# EAGLE design CELL PHONE DETECTOR (EAGLE 6.5.0)
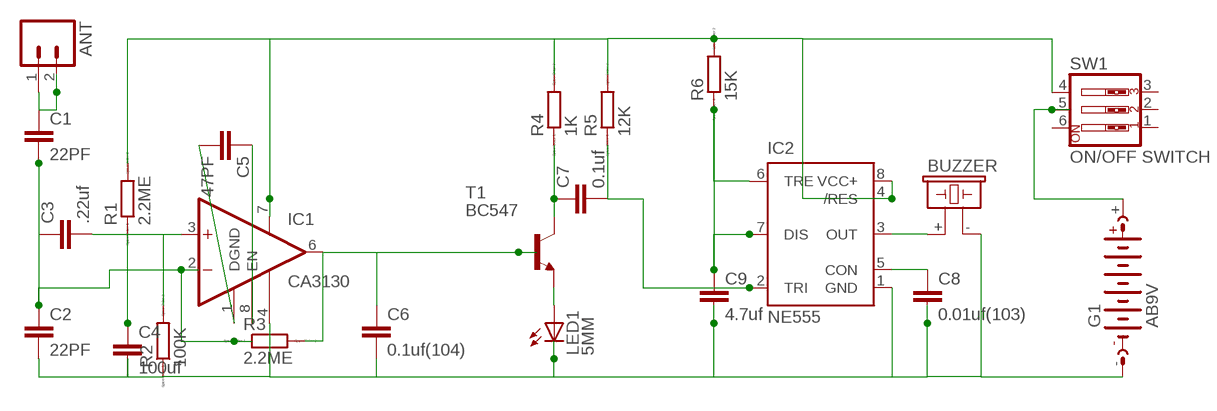
[diagram p0: schematic, sheet 1]

## Parts
ANT  M02  [02P]
BUZZER  F/CM12P  [F/CM12P]
C1  22PF  C2.5/6  [C2.5-6]
C2  22PF  C2.5/6  [C2.5-6]
C3  .22uf  C5/7.2  [C5B7.2]
C4  100uf  C2.5/6  [C2.5-6]
C5  47PF  C5/5  [C5B5]
C6  0.1uf(104)  C5/5  [C5B5]
C7  0.1uf  C5/5  [C5B5]
C8  0.01uf(103)  C5/5  [C5B5]
C9  4.7uf  C2,5-3  [C2.5-3]
G1  AB9V  [AB9V]
IC1  CA3130  OPA726P  [DIL08]
IC2  NE555  [DIL-08]
LED1  5MM  LED5MM  [LED5MM]
R1  2.2ME  R0204/7  [0204/7]
R2  100K  R0204/7  [0204/7]
R3  2.2ME  R0204/7  [0204/7]
R4  1K  R0204/7  [0204/7]
R5  12K  R0204/7  [0204/7]
R6  15K  R0204/7  [0204/7]
SW1  ON/OFF SWITCH  SW_DIP-3  [EDG-03]
T1  BC547  [TO92]

## Nets
N$1: C3.2 C4.1 IC1.3(+IN) R1.1 R2.2
N$2: C1.2 C2.1 C3.1 IC1.2(-IN) R3.1
N$3: ANT.1 ANT.2 C1.1
N$4: BUZZER.- C2.2 C4.2 C6.2 C8.2 C9.2 G1.- IC1.4(V-) IC2.1(GND) LED1.K(C) R2.1
N$7: C6.1 IC1.6(OUT) R3.2 T1.2(B)
N$8: C5.2 IC1.1(DGND)
N$9: C5.1 IC1.8(EN)
N$10: LED1.A T1.1(E)
N$11: C7.1 R4.1 T1.3(C)
N$12: C7.2 IC2.2(TRI) R5.1
N$13: IC1.7(V+) IC2.4(/RES) IC2.8(VCC+) R1.2 R4.2 R5.2 R6.2 SW1.4
N$14: C9.1 IC2.6(TRE) IC2.7(DIS) R6.1
N$15: C8.1 IC2.5(CON)
N$16: BUZZER.+ IC2.3(OUT)
N$18: G1.+ SW1.5
Unconnected: SW1.1 SW1.2 SW1.3 SW1.6

## Library data of the parts
ANT = con-amp-quick:M02: AMP QUICK CONNECTOR; OC_FARNELL: unknown; OC_NEWARK: unknown
BUZZER = buzzer:F/CM12P: BUZZER Source: Buerklin; OC_FARNELL: unknown; OC_NEWARK: unknown
C1-C9 = capacitor-wima:C: CAPACITOR naming: grid - package width
G1 = battery:AB9V: 9-V BATTERY CLIP
IC1 = linear:OPA726: Very Low Noise, High-Speed, 12V CMOS Operational Amplifier with Shutdown Source: http://focus.ti.com/lit/ds/symlink/opa725.pdf
IC2 = st-microelectronics:NE555: General purpose bipolar Timer; MF: Arrow Electronics; MPN: NE555N; OC_FARNELL: 1467742; OC_NEWARK: 89K1486
LED1 = led:LED: LED OSRAM: - CHIPLED LG R971, LG N971, LY N971, LG Q971, LY Q971, LO R971, LY R971 LH N974, LH R974 LS Q976, LO Q976, LY Q976 LO Q996 - Hyper CHIPLED LW Q18S LB Q993, LB Q99A, LB R99A - SideLED LS A670, LO A670, LY A670, LG A670, LP A670 LB A673, LV A673, LT A673, LW A673 LH A674 LY A675 LS A676, LA A676, LO A676, LY A676, LW A676 LS A679, LY A679, LG A679 - Hyper Micro SIDELED® LS Y876, LA Y876, LO Y876, LY Y876 LT Y87S - SmartLED LW L88C, LW L88S LB L89C, LB L89S, LG L890 LS L89K, LO L89K, LY L89K LS L896, LA L896, LO L896, LY L896 - TOPLED LS T670, LO T670, LY T670, LG T670, LP T670 LSG T670, LSP T670, LSY T670, LOP T670, LYG T670 LG T671, LOG T671, LSG T671 LB T673, LV T673, LT T673, LW T673 LH T674 LS T676, LA T676, LO T676, LY T676, LB T676, LH T676, LSB T676, LW T676 LB T67C, LV T67C, LT T67C, LS T67K, LO T67K, LY T67K, LW E67C LS E67B, LA E67B, LO E67B, LY E67B, LB E67C, LV E67C, LT E67C LW T67C LS T679, LY T679, LG T679 LS T770, LO T770, LY T770, LG T770, LP T770 LB T773, LV T773, LT T773, LW T773 LH T774 LS E675, LA E675, LY E675, LS T675 LS T776, LA T776, LO T776, LY T776, LB T776 LHGB T686 LT T68C, LB T68C - Hyper Mini TOPLED® LB M676 - Mini TOPLED Santana® LG M470 LS M47K, LO M47K, LY M47K Source: http://www.osram.convergy.de LUXEON: - LUMILED® LXK2-PW12-R00, LXK2-PW12-S00, LXK2-PW14-U00, LXK2-PW14-V00 LXK2-PM12-R00, LXK2-PM12-S00, LXK2-PM14-U00 LXK2-PE12-Q00, LXK2-PE12-R00, LXK2-PE12-S00, LXK2-PE14-T00, LXK2-PE14-U00 LXK2-PB12-K00, LXK2-PB12-L00, LXK2-PB12-M00, LXK2-PB14-N00, LXK2-PB14-P00, LXK2-PB14-Q00 LXK2-PR12-L00, LXK2-PR12-M00, LXK2-PR14-Q00, LXK2-PR14-R00 LXK2-PD12-Q00, LXK2-PD12-R00, LXK2-PD12-S00 LXK2-PH12-R00, LXK2-PH12-S00 LXK2-PL12-P00, LXK2-PL12-Q00, LXK2-PL12-R00 Source: www.luxeon.com KINGBRIGHT: KA-3528ASYC Source: www.kingbright.com
R1-R6 = eagle-ltspice:R: RESISTOR, European symbol; SPICEMODEL: NONE; SPICEPREFIX: R
SW1 = special:SW_DIP-3: DIP SWITCH
T1 = transistor:BC547: NPN TRANSISTOR

## Board
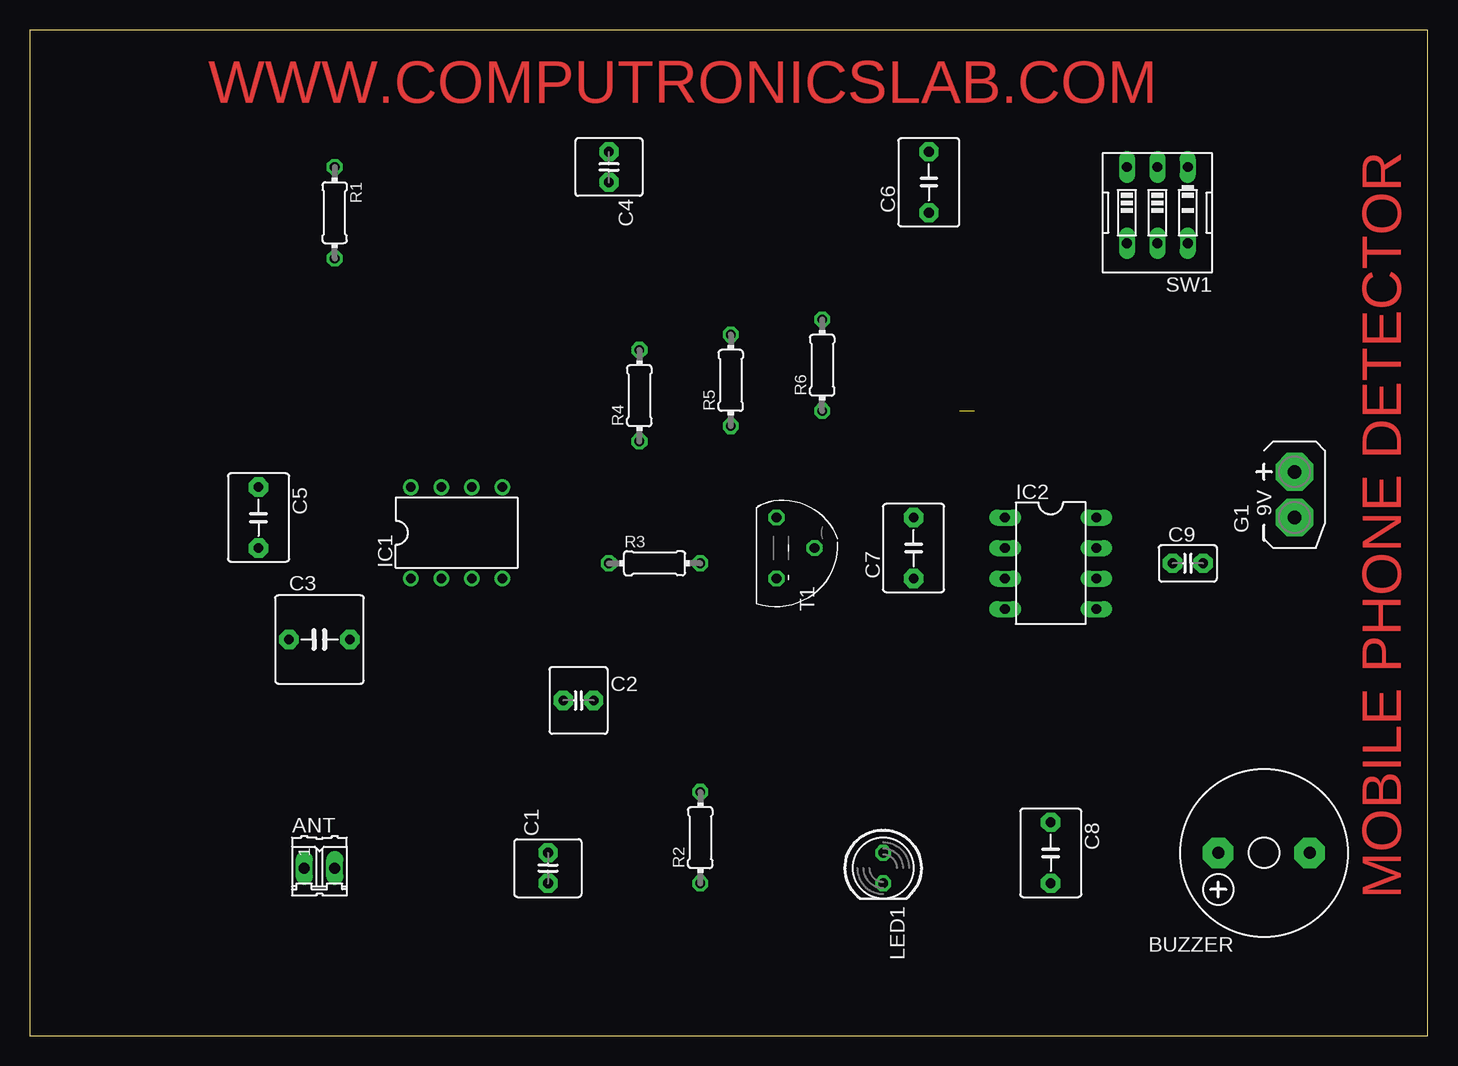
[diagram p1: board, top side]
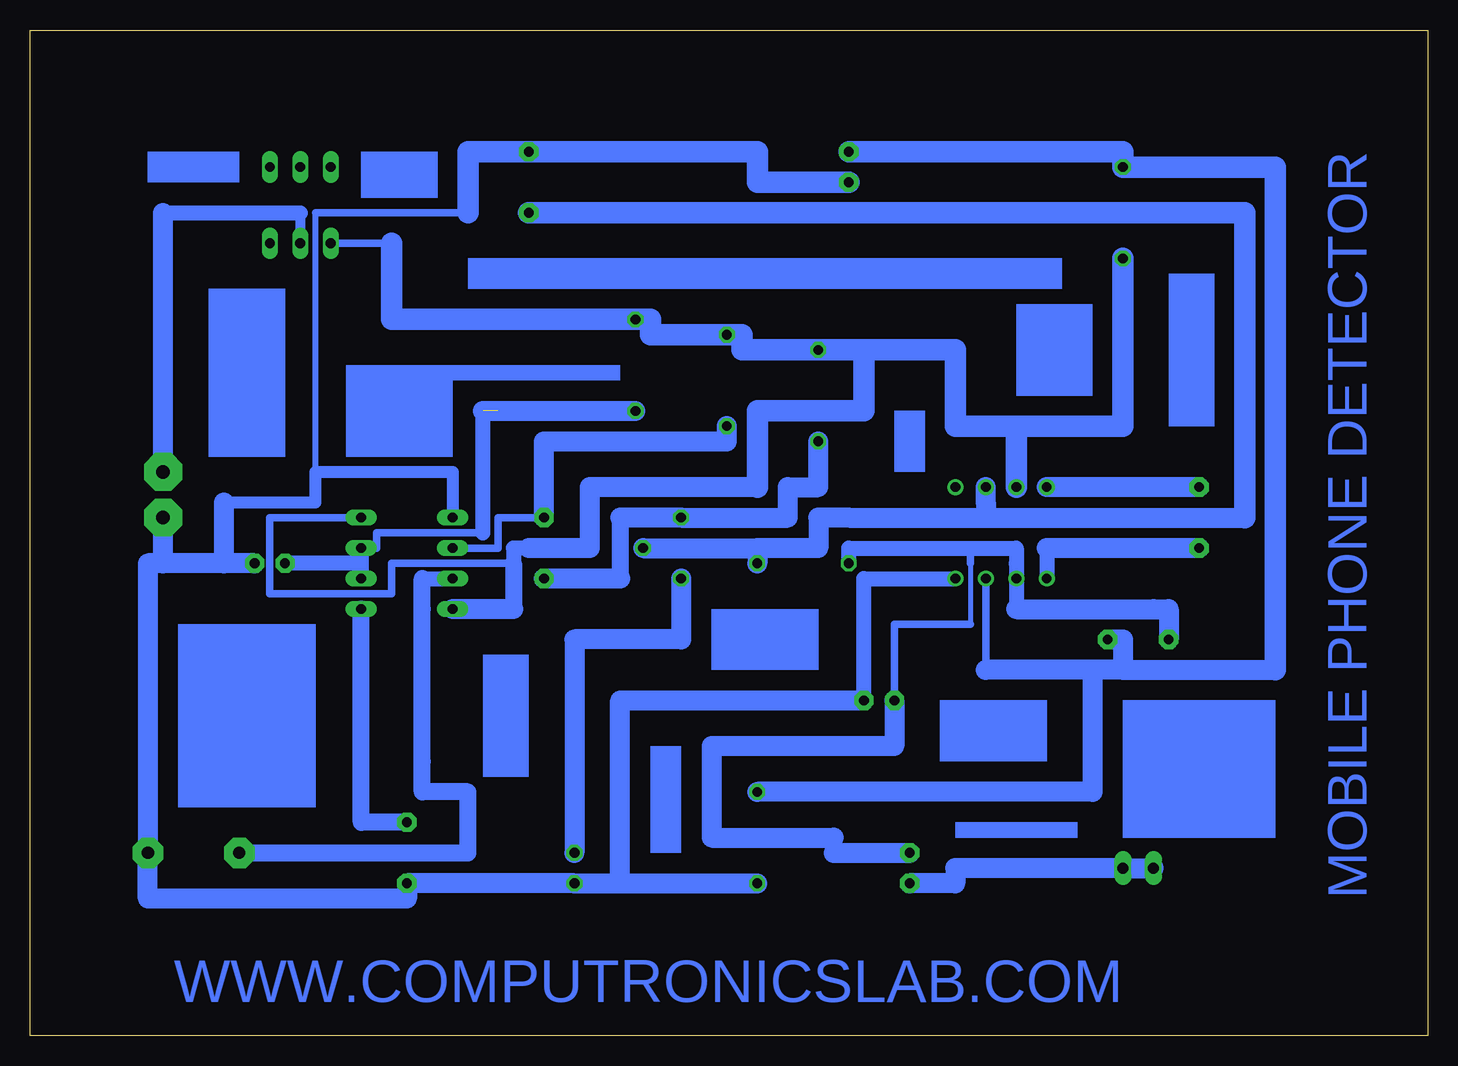
[diagram p2: board, bottom side, seen from below]

Size 116.51 x 83.81 mm. Coordinates in mm from the lower left corner, seen from the top.
Outline: 0,0 116.51,0 116.51,83.81 0,83.81 0,0
Copper layers (1*16): Top 0.035mm / dielectric 1.5mm / Bottom 0.035mm
Design rules "default": minimum track width 10mil, minimum drill 24mil, track to track 8mil, track to pad 8mil, pad to pad 8mil, via to via 8mil, smd to smd 8mil, copper to edge 40mil, drill to drill 8mil, minimum pad ring 10mil, minimum via ring 8mil, stop-mask expansion 4mil, vias tented up to drill 0mil, thermal gap 10mil

### Footprints (pad centres in the part's own frame; a part is rotated, then mirrored left to right if it is on the bottom)
02P = drill 0.914 long: 1 -1.27,0; 2 1.27,0
F/CM12P = drill 1.016 pad 2.54 octagon: + 3.81,0; - -3.81,0
C2.5-6 = drill 0.813 pad 1.6 octagon: 1 -1.27,0; 2 1.27,0
C5B7.2 = drill 0.813 pad 1.6 octagon: 1 -2.54,0; 2 2.54,0
C5B5 = drill 0.813 pad 1.6 octagon: 1 -2.54,0; 2 2.54,0
C2.5-3 = drill 0.813 pad 1.6 octagon: 1 -1.27,0; 2 1.27,0
AB9V = drill 1.118 pad 3.15 octagon: + 0,2.54; - 0,-1.27
DIL08 = drill 0.813 pad 1.27: 1 -3.81,-3.81; 2 -1.27,-3.81; 3 1.27,-3.81; 4 3.81,-3.81; 5 3.81,3.81; 6 1.27,3.81; 7 -1.27,3.81; 8 -3.81,3.81
DIL-08 = drill 0.813 long: 1 -3.81,-3.81; 2 -1.27,-3.81; 3 1.27,-3.81; 4 3.81,-3.81; 5 3.81,3.81; 6 1.27,3.81; 7 -1.27,3.81; 8 -3.81,3.81
LED5MM = drill 0.813 octagon: A -1.27,0; K 1.27,0
0204/7 = drill 0.813 octagon: 1 -3.81,0; 2 3.81,0
EDG-03 = drill 0.813 long: 1 -2.54,-3.81; 2 0,-3.81; 3 2.54,-3.81; 4 2.54,2.54; 5 0,2.54; 6 -2.54,2.54
TO92 = drill 0.813 octagon: 1 2.54,-1.27; 2 0,1.905; 3 -2.54,-1.27

### Placement (x,y rotation side)
ANT  24.13,13.97 0 top
BUZZER  102.87,15.24 180 top
C1  43.18,13.97 90 top
C2  45.72,27.94 0 top
C3  24.13,33.02 0 top
C4  48.26,72.39 270 top
C5  19.05,43.18 270 top
C6  74.93,71.12 90 top
C7  73.66,40.64 90 top
C8  85.09,15.24 270 top
C9  96.52,39.37 0 top
G1  105.41,44.45 0 top
IC1  35.56,41.91 0 top
IC2  85.09,39.37 270 top
LED1  71.12,13.97 270 top
R1  25.4,68.58 270 top
R2  55.88,16.51 90 top
R3  52.07,39.37 0 top
R4  50.8,53.34 90 top
R5  58.42,54.61 90 top
R6  66.04,55.88 90 top
SW1  93.98,68.58 180 top
T1  63.5,40.64 270 top

### Tracks (layer width: path | path; a pad name or v marks a point on that pad's centre or on a via)
N$1
  Bottom 0.61: 36.83,30.48 IC1.3
  Bottom 1.676: R2.2 27.94,20.32 27.94,30.48 | 25.4,30.48 27.94,30.48 | 27.94,30.48 36.83,30.48 | C3.2 25.4,33.02 25.4,30.48 | 25.4,30.48 12.7,30.48
  Bottom 1.778: C4.1 25.4,73.66 R1.1 12.7,72.39 12.7,30.48
N$2
  Bottom 0.254: 49.53,16.51 49.53,15.24
  Bottom 0.406: 38.1,39.37 38.1,34.29
  Bottom 0.61: 38.1,39.37 38.1,40.64 34.29,40.64 | C2.1 44.45,34.29 38.1,34.29
  Bottom 1.27: R3.1 48.26,40.64 34.29,40.64 34.29,39.37 IC1.2 34.29,35.56
  Bottom 1.676: 49.53,15.24 C1.2 | 49.53,16.51 59.69,16.51 59.69,24.13 44.45,24.13 C2.1 | C3.1 21.59,35.56 22.86,35.56 34.29,35.56
N$3
  Bottom 1.676: ANT.1 ANT.2 39.37,13.97 39.37,12.7 C1.1
N$4
  Bottom 0.254: C9.2 100.33,39.37
  Bottom 0.508: 92.71,44.45 92.71,68.58
  Bottom 0.61: 92.71,68.58 80.01,68.58
  Bottom 1.016: IC2.1 81.28,46.99 92.71,46.99 92.71,44.45 100.33,44.45
  Bottom 1.27: IC1.4 46.99,38.1 C2.2
  Bottom 1.676: 67.31,12.7 LED1.K C8.2 85.09,11.43 106.68,11.43 BUZZER.- 106.68,39.37 105.41,39.37 | 67.31,12.7 R2.1 | 67.31,12.7 67.31,27.94 C2.2 | 100.33,39.37 100.33,44.45 | C9.2 105.41,39.37 | 105.41,39.37 G1.-
  Bottom 1.778: C4.2 55.88,71.12 55.88,73.66 C6.2 80.01,73.66 80.01,68.58
N$7
  Bottom 1.676: 36.83,43.18 48.26,43.18 50.8,43.18 50.8,40.64 55.88,40.64 | T1.2 55.88,40.64 | 55.88,40.64 R3.2 | 36.83,43.18 36.83,44.45 IC1.6 | 36.83,43.18 15.24,43.18
  Bottom 1.778: C6.1 15.24,68.58 15.24,43.18
N$8
  Bottom 1.27: 31.75,40.64 IC1.1
  Bottom 1.676: C5.2 31.75,40.64
N$9
  Bottom 1.676: C5.1 IC1.8
N$10
  Bottom 1.676: T1.1 62.23,33.02 71.12,33.02 LED1.A
N$11
  Bottom 1.422: 67.31,43.18 67.31,38.1
  Bottom 1.676: R4.1 50.8,45.72 53.34,45.72 53.34,43.18 T1.3 67.31,43.18 | 67.31,38.1 C7.1
N$12
  Bottom 0.61: IC2.2 77.47,40.64 77.47,43.18 C7.2
  Bottom 1.676: R5.1 58.42,49.53 73.66,49.53 C7.2
N$13
  Bottom 0.61: IC2.8 96.52,43.18 96.52,36.83 86.36,36.83 86.36,39.37 76.2,39.37 | 86.36,66.04 SW1.4
  Bottom 1.27: 74.93,40.64 76.2,40.64 76.2,39.37
  Bottom 1.422: 76.2,39.37 76.2,35.56
  Bottom 1.676: 76.2,35.56 IC2.4 | 74.93,40.64 69.85,40.64 69.85,45.72 55.88,45.72
  Bottom 1.778: 46.99,57.15 39.37,57.15 39.37,50.8 34.29,50.8 | 34.29,50.8 IC1.7 | 34.29,50.8 25.4,50.8 R1.2 | 46.99,57.15 R4.2 57.15,57.15 57.15,58.42 R5.2 64.77,58.42 64.77,59.69 R6.2 86.36,59.69 86.36,66.04 | 46.99,57.15 46.99,52.07 55.88,52.07 55.88,45.72
N$14  (1 unrouted)
  Bottom 0.61: 78.74,41.91 87.63,41.91 87.63,40.64 IC2.7
  Bottom 1.27: 78.74,41.91 78.74,52.07 | IC2.7 88.9,39.37 | 88.9,39.37 IC2.6 | 88.9,39.37 C9.1
  Bottom 1.676: 78.74,52.07 76.2,52.07 | 77.47,52.07 R6.1
N$15
  Bottom 1.422: IC2.5 88.9,17.78 C8.1
N$16
  Bottom 1.27: 83.82,38.1 IC2.3
  Bottom 1.422: 83.82,38.1 83.82,35.56 83.82,22.86 83.82,20.32 80.01,20.32 80.01,15.24 83.82,15.24 BUZZER.+
N$18
  Bottom 0.813: 93.98,68.58 SW1.5
  Bottom 1.27: 105.41,68.58 93.98,68.58
  Bottom 1.676: G1.+ 105.41,68.58
(copper drawn outside any net)
  shapes: Bottom area x16

### Text on the board
Top: WWW.COMPUTRONICSLAB.COM | MOBILE PHONE DETECTOR
Bottom: MOBILE PHONE DETECTOR | WWW.COMPUTRONICSLAB.COM